# EAGLE design 0241_Current_Measurement (EAGLE 9.6.2)
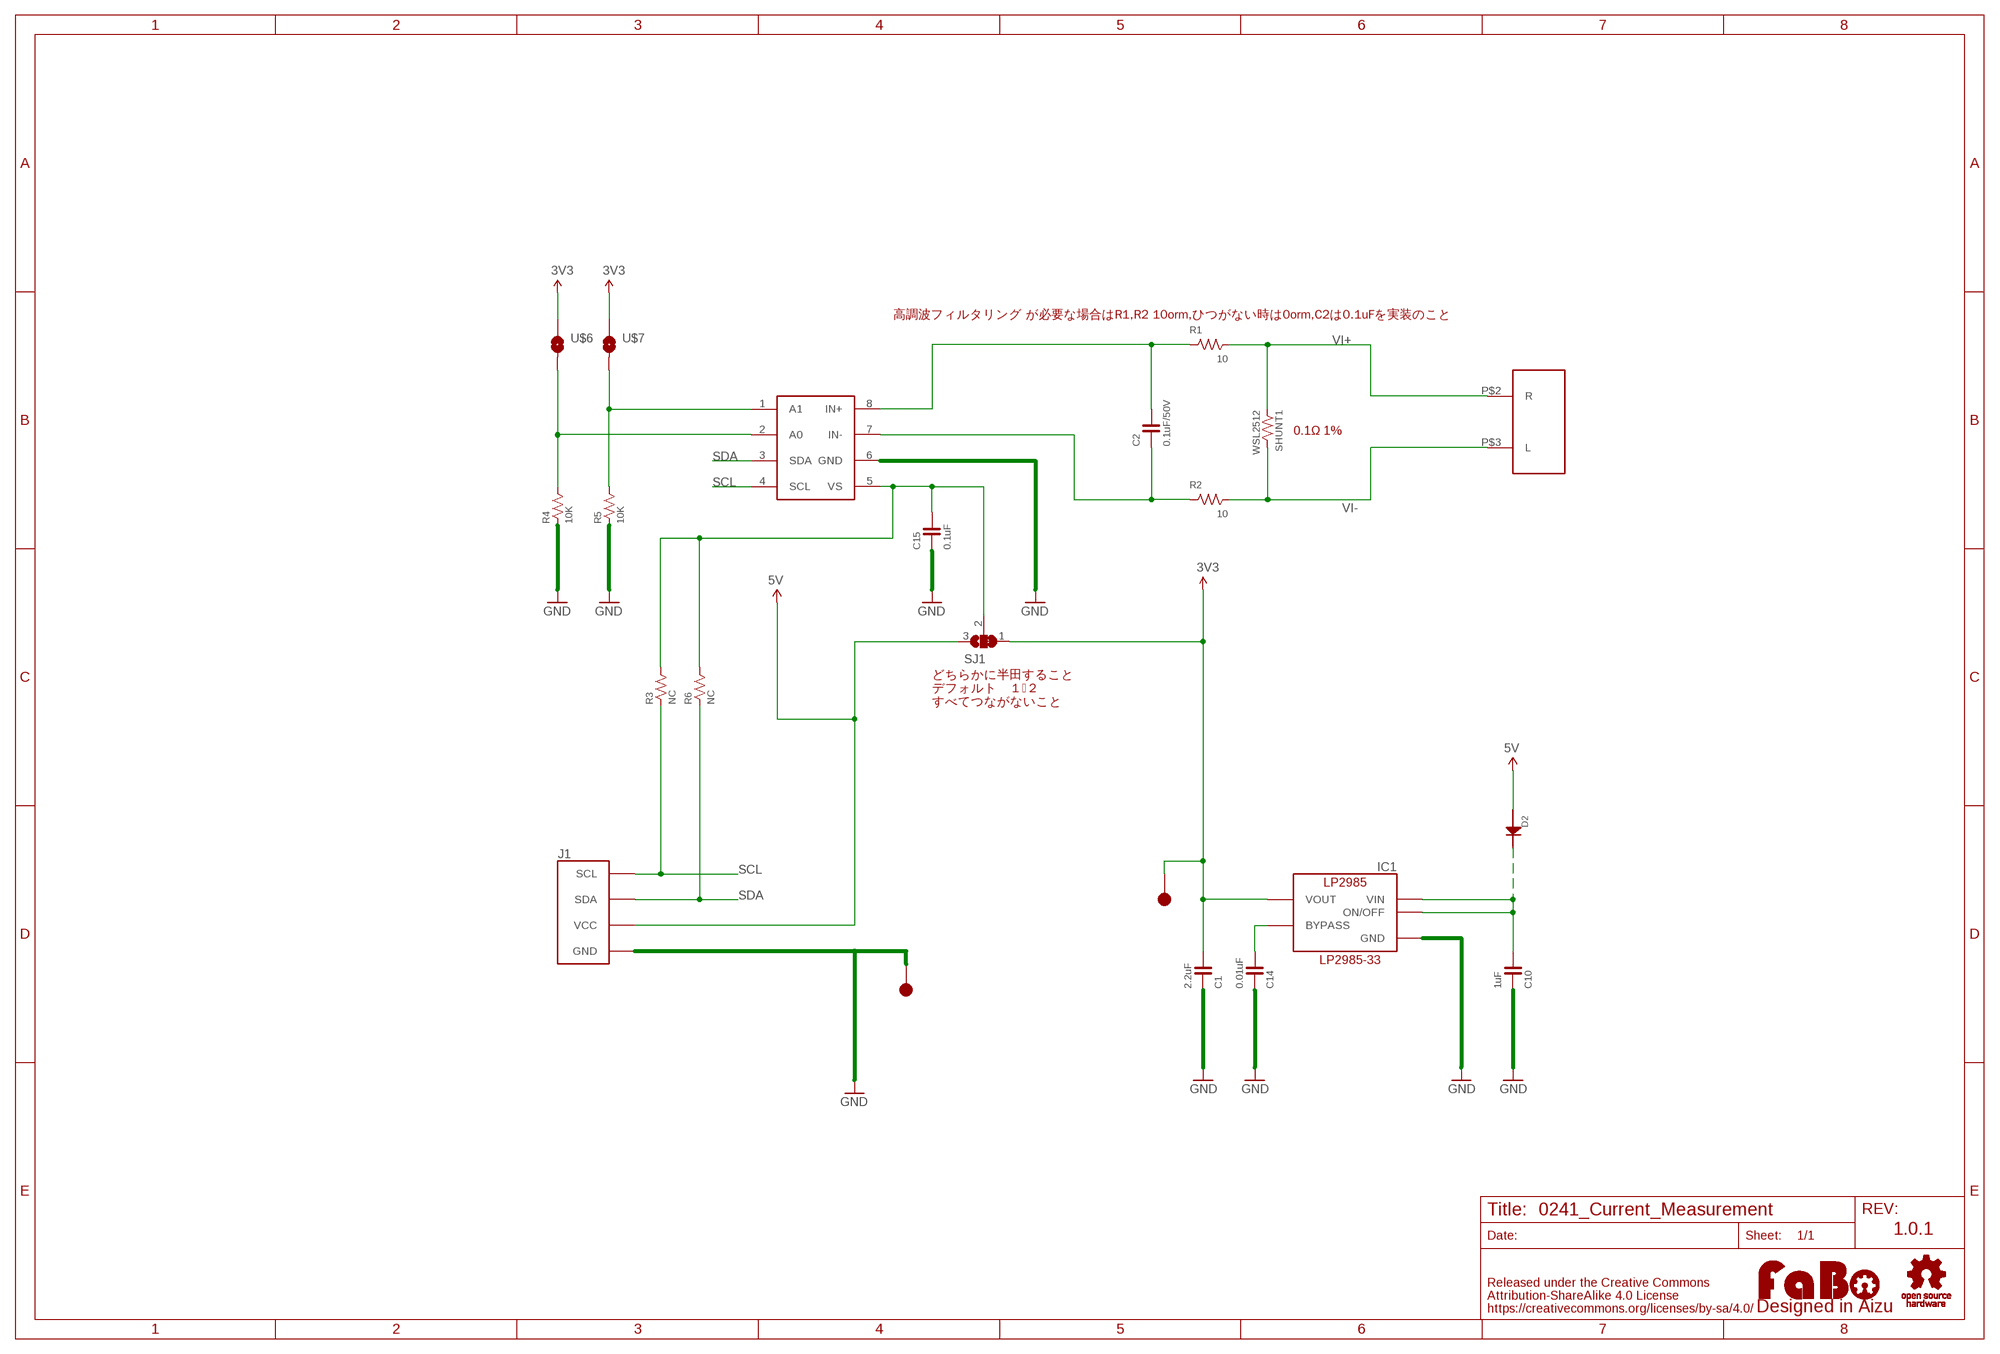
[diagram p0: schematic, sheet 1]

## Parts
C1  2.2uF  CAPACITOR-0603  [0603]
C2  0.1uF/50V  CAPACITOR-0603  [0603]
C10  1uF  CAPACITOR-0603  [0603]
C14  0.01uF  CAPACITOR-0603  [0603]
C15  0.1uF  CAPACITOR-0603  [0603]
D2  1N4148  [1N4148W]
IC1  LP2985-33  LP2985-33DBV  [SOT-23-5]
J1  FABO_BRICK_I2C-S04B-PASK-2  [FABO_BRICK_I2C_S04B-PASK-2]
LOGO1  LOGO_FABO-M  [LOGO_FABO_M]
R1  10  RESISTOR-0603  [0603]
R2  10  RESISTOR-0603  [0603]
R3  NC  RESISTOR-0603  [0603]
R4  10K  RESISTOR-0603  [0603]
R5  10K  RESISTOR-0603  [0603]
R6  NC  RESISTOR-0603  [0603]
SHUNT1  WSL2512  [2512INCH]
SJ1  SJ2W  [SJ_2]
TP1  TP-15  [TP-15]
TP5  TP-15  [TP-15]
U$1  TI-INA219  [TI-INA219]
U$5  2606-1102/020-000  [2606-1102/020-000]
U$6  FABO-SMD-JUMPER-SELECT-NARROW  [SMD-JUMPER_SELECT_NARROW]
U$7  FABO-SMD-JUMPER-SELECT-NARROW  [SMD-JUMPER_SELECT_NARROW]
U$8  LOGO_OSHW-M_BOTTOM  [LOGO_OSHW_M_BOTTOM]

## Nets
3V3: C1.2 IC1.5(VOUT) SJ1.1 TP5.1 U$6.1 U$7.1
5V: D2.ANODE J1.VCC SJ1.3
GND: C1.1 C10.1 C14.1 C15.1 IC1.2(GND) J1.GND R4.1 R5.1 TP1.1 U$1.6(GND)
N$2: R5.2 U$1.1(A1) U$7.2
N$3: R4.2 U$1.2(A0) U$6.2
N$4: C15.2 R3.2 R6.2 SJ1.2 U$1.5(VS)
N$5: C2.2 R1.2 U$1.8(IN+)
N$6: C2.1 R2.2 U$1.7(IN-)
N$11: C10.2 D2.CATHODE IC1.1(VIN) IC1.3(ON/OFF)
N$30: C14.2 IC1.4(BYPASS)
SCL: J1.SCL R3.1 U$1.4(SCL)
SDA: J1.SDA R6.1 U$1.3(SDA)
VI+: R1.1 SHUNT1.P$1 U$5.P$2(R)
VI-: R2.1 SHUNT1.P$2 U$5.P$3(L)

## Notes on the sheet
- 高調波フィルタリング が必要な場合はR1,R2 10orm,ひつがない時は0orm,C2は0.1uFを実装のこと
- 0.1Ω 1%
- どちらかに半田すること
  デフォルト　１−２
  すべてつながないこと
- LP2985-33
- 1.0.1

## Library data of the parts
C1 C2 C10 C14 C15 = FaBo-Capacitor:CAPACITOR: CAPACITOR
D2 = FaBo-Diode:1N4148
IC1 = FaBo-Supply:LP2985: LP2985
J1 = FaBo-Template:FABO_BRICK_I2C: FaBo Brick I2C
LOGO1 = component:LOGO_FABO
R1-R6 = FaBo-Resistors:RESISTOR: RESISTOR
SHUNT1 = FaBo-Resistors:WSL2512
SJ1 = jumper:SJ2W: SMD solder JUMPER
TP1 TP5 = FaBo-Supply:TP
U$1 = FaBo-Sensor:TI-INA219
U$5 = FaBo-Terminal:2606-1102/020-000
U$6 U$7 = FaBo-PIN:FABO-SMD-JUMPER-SELECT-NARROW
U$8 = component:LOGO_OSHW

## Board
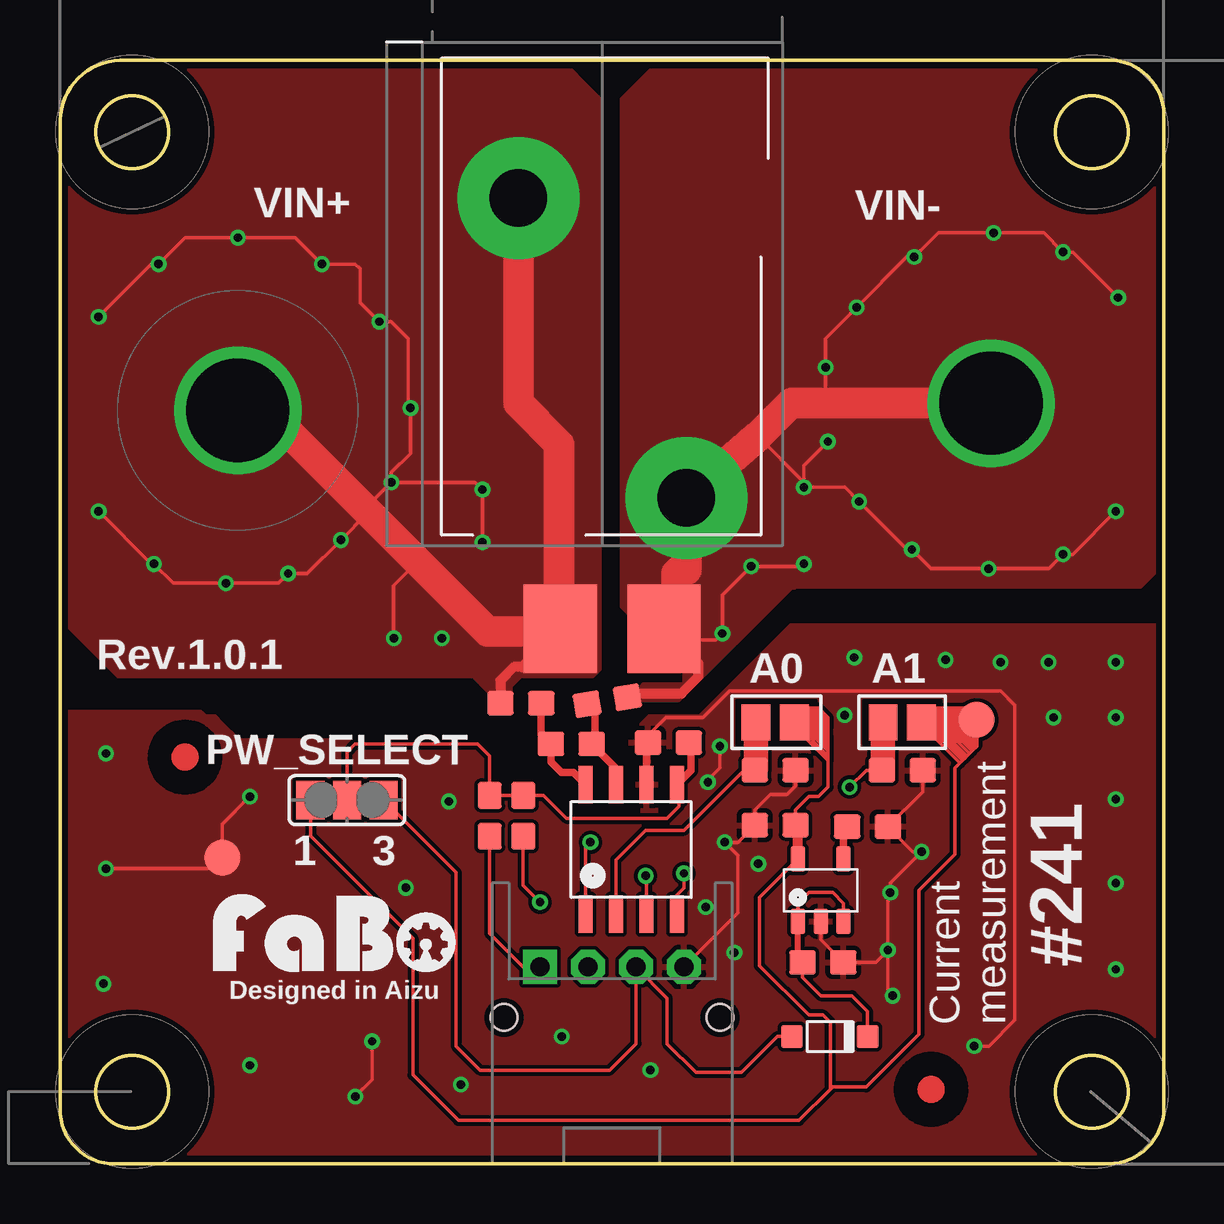
[diagram p1: board, top side]
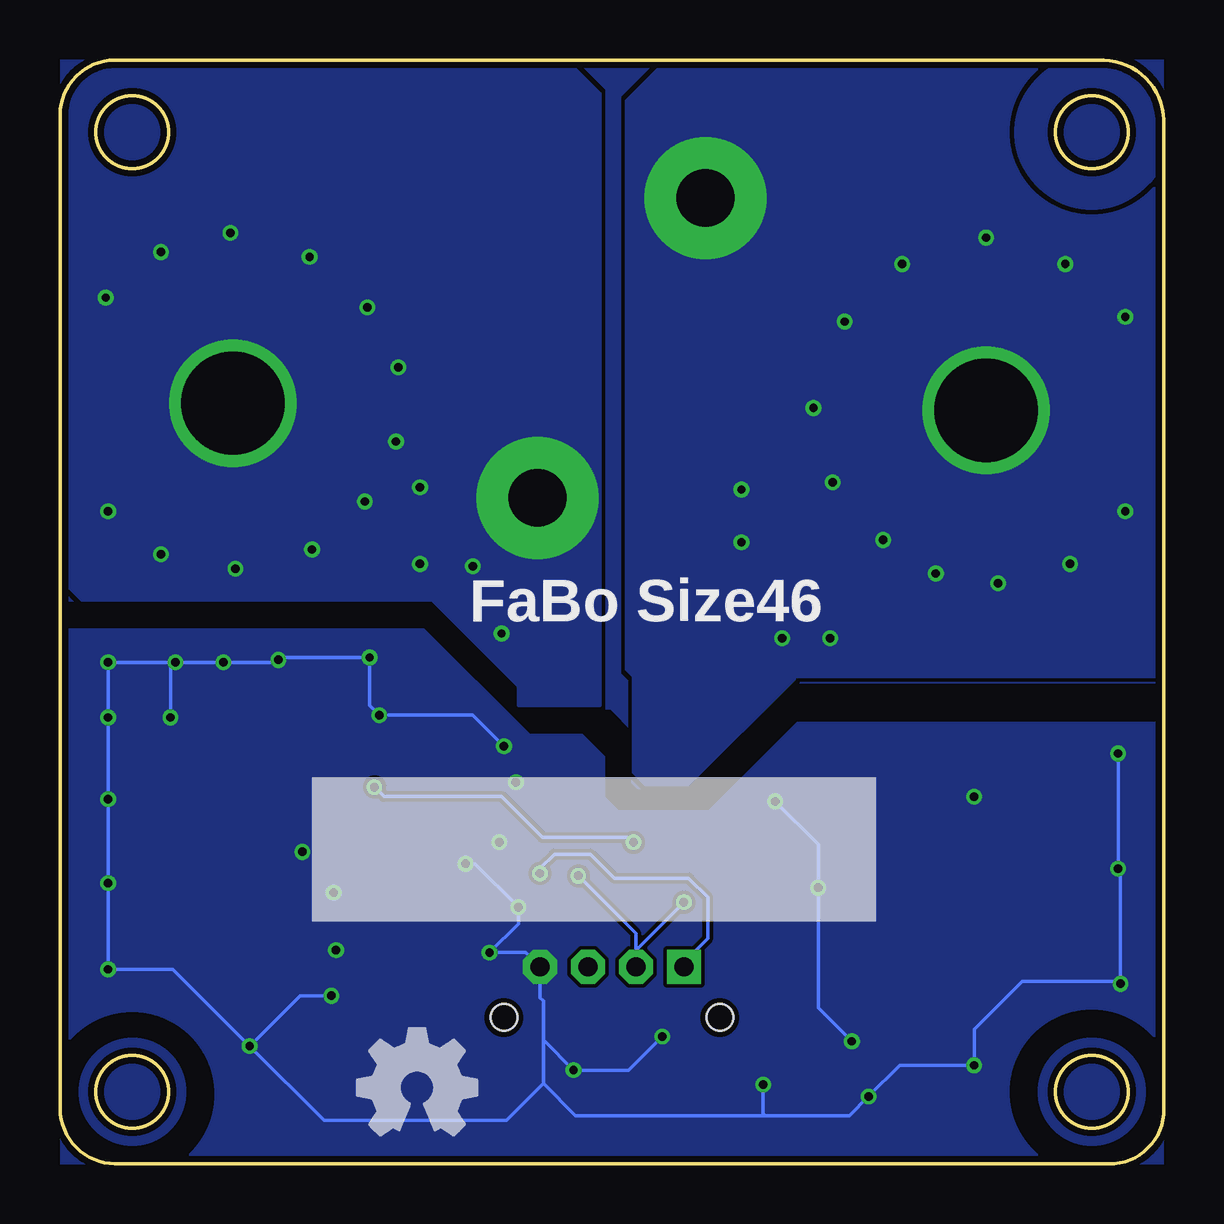
[diagram p2: board, bottom side, seen from below]

Size 46.02 x 46.02 mm. Coordinates in mm from the lower left corner, seen from the top.
Outline: 0.01,2.51 0.01,43.51 arc-87 2.51,46.01 43.51,46.01 arc-100 46.01,43.51 46.01,2.51 arc-99 43.51,0.01 2.51,0.01 arc-102 0.01,2.51
Outline: circle at 3.01,3.01 radius 1.5
Outline: circle at 43.01,3.01 radius 1.5
Outline: circle at 43.01,43.01 radius 1.5
Outline: circle at 3.01,43.01 radius 1.5
Copper layers (1*16): Top 0.035mm / dielectric 1.6mm / Bottom 0.035mm
Design rules "PCBway": minimum track width 6mil, minimum drill 12mil, track to track 6mil, track to pad 6mil, pad to pad 6mil, via to via 6mil, smd to smd 6mil, copper to edge 10mil, drill to drill 10mil, minimum pad ring 10mil, minimum via ring 6mil, stop-mask expansion 2mil, vias tented up to drill 100mil, thermal gap 8mil
tRestrict: area 22.7,20.1 to 23.2,45.2; area -0.3,39.7 to 6.4,46.4; area 39.7,39.7 to 46.4,46.4; area -0.3,-0.3 to 6.4,6.4; area 39.7,-0.3 to 46.4,6.4; area -0.4,17.4 to 19.6,19.9; area 18,15.2 to 21.4,17.2; area 22.7,16.8 to 46.8,23.9; area 25,14.7 to 26,17.2; 27 lines
bRestrict: area -0.3,39.7 to 6.4,46.4; area 39.7,-0.4 to 46.4,6.3; area -0.3,-0.3 to 6.4,6.4; area 0.2,0.2 to 5.8,5.8; area 40.2,0.2 to 45.8,5.8; area -0.4,14.8 to 46.4,23.3

### Footprints (pad centres in the part's own frame; a part is rotated, then mirrored left to right if it is on the bottom)
0603 = smd 1.1 x 1: 1 -0.85,0; 2 0.85,0
1N4148W = smd 0.9 x 0.95: ANODE 0,0; CATHODE 3.15,0
SOT-23-5 = smd 0.6 x 1.05: 1 -0.95,-1.3; 2 0,-1.3; 3 0.95,-1.3; 4 0.95,1.3; 5 -0.95,1.3
FABO_BRICK_I2C_S04B-PASK-2 = drill 0.8 pad 1.422 octagon: GND -3,0; SDA 1,0; VCC -1,0 | drill 0.8 pad 1.422 square: SCL 3,0 | hole 1.1: 4.5,2.1; -4.5,2.1
2512INCH = smd 3.05 x 3.68: P$1 -2.16,0; P$2 2.16,0
SJ_2 = smd 1.168 x 1.6: 1 -1.524,0; 2 0,0; 3 1.524,0
TP-15 = smd 1.5 x 1.5: 1 0,0
TI-INA219 = smd 1.55 x 0.6: 1 -2.7,1.905; 2 -2.7,0.635; 3 -2.7,-0.635; 4 -2.7,-1.905; 5 2.7,-1.905; 6 2.7,-0.635; 7 2.7,0.635; 8 2.7,1.905
2606-1102/020-000 = drill 2.4 pad 5.08: P$2 3.5,-6.25; P$3 -3.5,6.25
SMD-JUMPER_SELECT_NARROW = smd 1.2 x 1.5: 1 -0.8,0; 2 0.8,0

### Placement (x,y rotation side)
C1  29.81,14.12 0 top
C2  21.31,17.51 180 top
C10  31.8,8.4 180 top
C14  33.66,14.06 180 top
C15  25.36,17.56 0 top
D2  30.51,5.31 0 top
IC1  31.71,11.41 0 top
J1  23.01,8.21 180 top
LOGO1  11.44,7.63 0 top
R1  19.21,19.21 0 top
R2  22.81,19.31 190 top
R3  17.91,14.51 90 top
R4  29.81,16.41 180 top
R5  35.11,16.41 180 top
R6  19.31,14.51 90 top
SHUNT1  23.01,22.31 0 top
SJ1  11.96,15.17 0 top
TP1  6.76,12.76 0 top
TP5  38.21,18.51 0 top
U$1  23.81,13.11 90 top
U$3  [MARK_POINT_3MM]  36.31,3.11 0 top
U$4  [MARK_POINT_3MM]  5.21,16.96 0 top
U$5  22.61,34.01 180 top
U$6  29.81,18.41 180 top
U$7  35.11,18.41 180 top
U$8  31.13,3.19 0 top

### Tracks (layer width: path | path; a pad name or v marks a point on that pad's centre or on a via)
3V3
  Top 0.152: 30.66,13.96 C1.2 30.66,14.76 31.21,15.31 31.61,15.31 32.01,15.71 32.01,16.81 | 32.01,16.81 32.01,17.01 | 32.01,17.01 32.01,17.21 | 32.01,17.21 32.01,17.41 | 32.01,17.41 32.01,17.51 | 32.01,17.51 32.01,17.71 | 32.01,17.71 32.01,17.81 | 32.01,17.81 32.01,18.21 | 31.71,18.51 31.91,18.31 | 31.91,18.31 31.96,18.26 | 31.96,18.26 32.01,18.21 | SJ1.1 10.44,13.69 14.71,9.41 14.71,3.71 16.61,1.81 30.81,1.81 32.11,3.11 | 32.11,3.11 32.21,3.21 33.61,3.21 35.81,5.41 35.81,11.41 37.31,12.91 37.31,16.51 37.51,16.71 | 32.11,3.11 32.11,5.91 31.81,6.21 31.21,6.21 29.15,8.27 29.15,11.1 IC1.5 | TP5.1 38.21,18.31 | 38.21,18.31 38.21,17.61 | 38.21,17.61 38.21,17.41 38.01,17.21 | 38.01,17.21 37.91,17.11 | 37.91,17.11 37.81,17.01 | 37.81,17.01 37.71,16.91 | 37.71,16.91 37.61,16.81 | 37.61,16.81 37.51,16.71 | 38.21,18.31 38.11,18.41 37.11,18.41 | U$6.1 30.71,18.51 | 30.71,18.51 31.71,18.51 | 31.11,19.01 31.61,19.01 31.81,18.81 | 31.11,17.81 32.01,17.81 | 31.81,18.81 31.91,18.71 | 31.91,18.71 32.01,18.61 32.01,18.21 | 30.91,18.81 31.81,18.81 | 31.91,17.91 30.61,17.91 30.61,18.01 | 30.61,18.01 31.91,18.01 | 30.71,18.11 31.91,18.11 31.96,18.16 31.96,18.26 | 30.71,18.11 30.61,18.11 | 30.61,18.21 31.91,18.21 | 30.61,18.31 30.71,18.31 | 30.71,18.31 31.91,18.31 | U$6.1 31.91,18.41 | 30.61,18.51 30.71,18.51 | 31.71,18.51 31.91,18.51 | 30.61,18.61 31.91,18.61 | 30.61,18.71 30.71,18.71 | 30.71,18.71 31.91,18.71 | 30.31,18.91 30.41,18.91 | 30.41,18.91 31.61,18.91 | 36.31,19.01 36.61,19.01 | 36.61,19.01 37.71,19.01 | 36.31,18.91 36.71,18.91 | 36.71,18.91 37.71,18.91 | 37.71,18.81 36.31,18.81 U$7.1 | 36.31,18.71 37.71,18.71 | 36.31,18.51 36.61,18.51 | 36.61,18.51 37.11,18.51
  Top 0.152: 37.11,18.51 37.71,18.51 | 36.41,18.31 36.71,18.31 | 36.71,18.31 37.01,18.31 | 37.01,18.31 37.71,18.31 | 36.61,18.21 37.01,18.21 | 37.01,18.21 37.71,18.21 | 36.31,18.01 36.41,18.01 | 36.41,18.01 36.81,18.01 | 36.81,18.01 37.71,18.01 | 36.31,18.11 36.41,18.11 | 37.71,18.11 36.91,18.11 | 36.91,18.11 36.41,18.11 | 36.51,17.91 36.31,17.91 36.31,18.01 | 36.51,17.91 36.71,17.91 | 36.71,17.91 37.71,17.91 | 36.51,17.81 36.61,17.81 | 36.61,17.81 37.91,17.81 | 36.51,18.41 36.61,18.41 | 36.61,18.41 37.01,18.41 | 37.01,18.41 37.11,18.41 | U$7.1 36.06,18.56 | 36.06,18.56 36.11,18.61 36.71,18.61 | 36.71,18.61 37.71,18.61 | 36.61,17.81 36.51,17.91 | 36.26,18.16 36.01,18.41 U$7.1 | 36.71,18.91 36.36,18.56 36.16,18.56 | 36.61,19.01 36.31,18.71 | 36.31,18.71 36.16,18.56 | 36.16,18.56 36.06,18.56 | 36.71,18.61 36.61,18.51 | 36.61,18.51 36.51,18.41 | 36.51,18.41 U$7.1 | 36.51,18.41 36.41,18.31 | 36.41,18.31 36.31,18.31 | 36.61,18.41 36.36,18.16 | 36.36,18.16 36.26,18.16 | 36.71,18.31 36.61,18.21 | 36.61,18.21 36.31,18.21 36.11,18.41 U$7.1 | 36.41,18.11 36.36,18.16 | 36.31,18.11 36.26,18.16 | 36.41,18.01 36.21,18.21 | 36.51,17.91 36.31,18.11 | 30.61,18.51 30.61,18.61 | 30.61,18.61 30.71,18.71 | 30.61,18.61 30.61,18.71 | 30.61,18.71 30.41,18.91 | U$7.1 36.21,18.71 36.31,18.71 | U$7.1 36.31,18.01 | 30.61,18.11 30.61,18.01 | 30.61,18.21 30.61,18.11 | U$6.1 30.61,18.21 | U$6.1 30.61,18.51 | 31.11,17.71 32.01,17.71 | 36.31,18.01 36.61,17.71 38.21,17.71 | 38.21,17.61 36.61,17.61 | 30.71,18.11 32.01,16.81 | 30.71,18.31 32.01,17.01 | 30.71,18.51 32.01,17.21 | 30.71,18.71 32.01,17.41 | 30.71,18.81 32.01,17.51 | 36.41,17.71 36.51,17.71 37.51,16.71 | 36.61,17.81 37.61,16.81 | 36.71,17.91 37.71,16.91
  Top 0.152: 36.81,18.01 37.81,17.01 | 36.91,18.11 37.91,17.11 | 37.01,18.21 38.01,17.21 | 37.01,18.31 38.01,17.31 | 37.01,18.41 38.01,17.41 | 37.11,18.41 38.11,17.41 | 37.11,18.51 38.11,17.51
  Top 0.305: 30.76,14.02 C1.2
  Top 0.406: IC1.5 30.76,14.02
5V
  Top 0.152: SJ1.3 16.51,12.15 16.51,4.91 17.51,3.91 22.91,3.91 24.01,5.01 J1.VCC 25.31,6.91 25.31,5.01 26.51,3.81 28.41,3.81 29.91,5.31 D2.ANODE
GND  (via drill 0.35)
  Top 0.152: v34.51,8.91 34,8.4 C10.1 31.71,9.34 IC1.2 | v34.71,7.01 34.51,7.21 v34.51,8.91 | v34.51,8.91 34.51,11.21 v34.61,11.31 34.61,11.71 v35.91,13.01 35.56,13.01 C14.1 35.96,15.51 R5.1 | R4.1 30.66,15.76 30.31,15.41 29.61,15.41 28.96,14.76 C1.1 28.25,13.41 v27.71,13.41 28.26,12.86 28.26,10.46 J1.GND | C15.1 24.51,17.86 25.26,18.61 26.81,18.61 27.91,19.71 39.21,19.71 39.81,19.11 39.81,6.01 38.71,4.91 v38.11,4.91 | v1.91,12.31 6.21,12.31 6.71,12.81 | TP1.1 6.76,14.16 v7.91,15.31 | v13.01,5.11 13.01,3.51 v12.31,2.81 | v27.01,15.91 27.01,16.01 27.51,16.51 v27.51,17.41
  Top 0.254: 6.71,12.81 TP1.1
  Top 0.305: U$1.6 24.45,17.5 C15.1
  Bottom 0.152: v1.91,17.11 v1.91,12.31 1.81,12.21 v1.81,7.51 1.91,7.61 5.91,7.61 7.91,5.61 v7.91,4.11 11.01,4.11 v12.31,2.81 13.11,2.01 16.61,2.01 | v38.11,4.91 41.31,8.11 v44.01,8.11 v44.01,11.71 v44.01,15.21 v44.01,18.61 v44.01,20.91 v41.21,20.91 | v38.11,4.91 36.01,7.01 v34.71,7.01 | 25.87,5.17 25.87,6.79 26.01,6.93 J1.GND 26.61,8.81 v28.11,8.81 26.91,10.01 v26.91,10.71 28.71,12.51 v29.11,12.51 | 25.87,5.17 25.87,3.35 | 25.87,3.35 27.41,1.81 35.01,1.81 v38.11,4.91 | 16.61,2.01 24.53,2.01 25.87,3.35 | v13.01,5.11 14.41,6.51 v14.41,11.51 14.41,13.31 v16.21,15.11 | v20.91,5.31 22.31,3.91 v24.61,3.91 25.87,5.17 | v41.21,20.91 41.41,20.71 v41.41,18.61 | v27.51,17.41 28.81,18.71 v32.71,18.71 33.11,19.11 v33.11,21.11 36.81,21.11 v36.91,21.01 37.01,20.91 v39.21,20.91 v41.21,20.91 | v16.71,3.31 16.71,2.11 16.61,2.01
  pour Top (rank 6): -1.39,-1.29 -1.39,46.81 47.11,46.81 47.11,-1.29
  pour Bottom (rank 5, no thermals): -2.99,47.71 47.71,47.71 47.71,-2.39 -2.99,-2.39
GND1
  pour Bottom (isolate 0.04, rank 6): 0.01,46.01 46.01,46.01 46.01,0.01 0.01,0.01
N$2  (via drill 0.35)
  Top 0.152: U$1.1 21.91,13.41 v22.11,13.41 | v32.91,15.71 33.61,16.41 R5.2 | 34.26,18.36 U$7.2
  Top 1.016: 34.31,18.1 U$7.2 34.31,16.46 R5.2
  Bottom 0.152: v22.11,13.41 22.31,13.61 25.91,13.61 27.61,15.31 32.51,15.31 v32.91,15.71
N$3
  Top 0.152: 23.21,10.45 U$1.2 23.18,12.68 24.41,13.91 26.01,13.91 28.51,16.41 28.81,16.41 | 28.91,16.46 R4.2 28.81,16.41 | 28.91,16.51 28.81,16.41 | 28.96,18.36 U$6.2
  Top 1.016: U$6.2 29.01,16.46 R4.2
N$4
  Top 0.152: 25.72,16.11 U$1.5 25.81,15.72 25.81,14.91 25.31,14.41 21.11,14.41 20.16,15.36 R6.2 | SJ1.2 11.96,17.16 12.31,17.51 17.41,17.51 17.91,17.01 R3.2 R6.2 | R6.2 19.16,15.36
  Top 0.305: U$1.5 26.31,16.41 26.31,17.46 C15.2
N$5
  Top 0.305: R1.2 20.06,17.91 C2.2 | C2.2 20.71,17.51 | 21.91,16.32 U$1.8 21.41,16.31 20.91,16.31 20.46,16.76 C2.2
N$6
  Top 0.305: U$1.7 23.16,15.83 23.16,16.51 C2.1 22.31,17.66 22.31,18.96 R2.2
N$11
  Top 0.152: IC1.3 32.66,10.86 32.21,11.31 31.21,11.31 30.76,10.86 IC1.1 | C10.2 30.95,7.77 31.71,7.01 33.01,7.01 33.66,6.36 D2.CATHODE
  Top 0.254: C10.2 30.76,8.59 IC1.1
N$30
  Top 0.305: IC1.4 32.66,13.91 C14.2
SCL  (via drill 0.35)
  Top 0.152: J1.SCL 19.31,8.21 17.91,9.61 R3.1 | v26.01,12.11 26.01,11.51 25.71,11.21 U$1.4
  Bottom 0.152: J1.SCL 20.01,8.41 19.01,9.41 19.01,11.11 19.81,11.91 22.91,11.91 23.91,12.91 25.41,12.91 26.01,12.31 v26.01,12.11
SDA  (via drill 0.35)
  Top 0.152: 19.31,13.76 R6.1 19.31,11.61 v20.01,10.91 | 24.61,10.58 U$1.3 24.45,11.98 v24.41,12.01
  Bottom 0.152: v20.01,10.91 22.01,8.91 J1.SDA 22.01,9.61 v24.41,12.01
VI+  (via drill 0.35, 4.3)
  Top 0.152: 14.91,25.11 13.91,24.11 v13.91,21.91 | v1.61,27.21 3.81,25.01 v3.91,25.01 4.71,24.21 v6.91,24.21 9.11,24.21 v9.51,24.61 10.31,24.61 v11.71,26.01 12.81,27.11 12.91,27.11 12.91,27.51 v13.81,28.41 | v13.81,28.41 13.81,28.81 14.61,29.61 v14.61,31.51 14.51,31.61 14.51,34.41 13.81,35.11 v13.31,35.11 12.51,35.91 12.51,37.31 12.31,37.51 v10.91,37.51 9.81,38.61 v7.41,38.61 5.21,38.61 v4.11,37.51 3.81,37.51 v1.61,35.31 | v13.81,28.41 17.31,28.41 v17.61,28.11 v17.61,25.91
  Top 0.254: SHUNT1.P$1 20.68,22.45 20.35,22.71 | SHUNT1.P$1 20.8,22.2 20.35,21.15 | 19.86,21.82 SHUNT1.P$1
  Top 0.305: 19.46,21.82 20.35,22.71
  Top 0.406: SHUNT1.P$1 19.25,20.71 18.91,20.71 18.36,20.16 R1.1
  Top 1.27: v7.41,31.41 8.61,31.41 12.91,27.11 14.91,25.11 17.82,22.2 20.8,22.2 20.8,30.02 19.11,31.71 U$5.P$2
  other vias: 15.91,21.91
  pour Top (no thermals): -0.79,46.31 20.61,46.31 22.51,44.41 22.51,20.61 22.21,20.31 19.21,20.31 18.91,20.01 18.81,19.91 18.81,19.71 17.81,19.71 17.21,20.31 2.41,20.31 -0.79,23.51
  pour Bottom (no thermals): -0.39,46.21 20.51,46.21 22.41,44.31 22.41,20.61 22.11,20.31 22.11,16.31 21.61,15.81 19.81,15.81 15.41,20.21 15.41,20.31 -0.39,20.31
VI-  (via drill 0.35, 4.3)
  Top 0.152: 25.49,23.13 SHUNT1.P$2 25.01,22.65 | 29.09,30.34 31.01,28.41 v31.01,28.21 | v31.01,28.21 32.71,28.21 v33.31,27.61 35.31,25.61 v35.51,25.61 36.31,24.81 v38.71,24.81 41.21,24.81 v41.81,25.41 42.21,25.41 v44.01,27.21 | v31.01,28.21 31.01,29.11 v32.01,30.11 | 31.91,31.71 v31.91,33.21 31.91,34.41 v33.21,35.71 35.31,37.81 v35.61,37.81 36.61,38.81 v38.91,38.81 41.01,38.81 v41.81,38.01 42.21,38.01 v44.11,36.11 | 25.64,21.84 27.34,21.84 v27.61,22.11 27.61,23.71 v28.81,24.91 30.91,24.91 v31.01,25.01
  Top 0.305: R2.1 23.96,19.61 | 23.96,21.5 SHUNT1.P$2
  Top 0.406: R2.1 23.8,19.61 25.91,19.61 26.61,20.31 26.61,20.87 25.64,21.84 SHUNT1.P$2
  Top 1.27: SHUNT1.P$2 25.7,22.84 25.7,24.61 25.81,24.72 26.11,24.76 U$5.P$3 29.09,30.34 30.46,31.71 31.91,31.71 v38.81,31.71
  Bottom 0.152: v31.01,28.21 31.01,28.11
  pour Top (no thermals): 23.41,44.41 24.71,45.71 46.41,45.71 46.41,25.41 45.01,24.01 30.51,24.01 25.81,19.31 24.21,19.31 24.21,19.91 24.31,20.01 26.01,20.01 26.01,20.61 23.41,23.21
  pour Bottom (no thermals): 23.51,44.61 25.11,46.21 46.71,46.21 46.71,25.11 45.11,23.51 30.51,23.51 26.91,19.91 26.91,19.11 23.51,19.11

### Text on the board
tPlace: VIN+ | VIN- | Rev.1.0.1 | A0 | A1 | PW_SELECT | 1 | 3 | Designed in Aizu | #241 | Current / measurement
bPlace: FaBo Size46
tDocu: FaBo Brick New Size Type 46 / 寸法図 | R-2.5